# Altium schematic sheet rv_pwr_es_ctrl.SchDoc: RV Essential: Logic Controller
size A4; DocumentNumber: 3; Revision: A; SheetNumber: 3; SheetTotal: 5
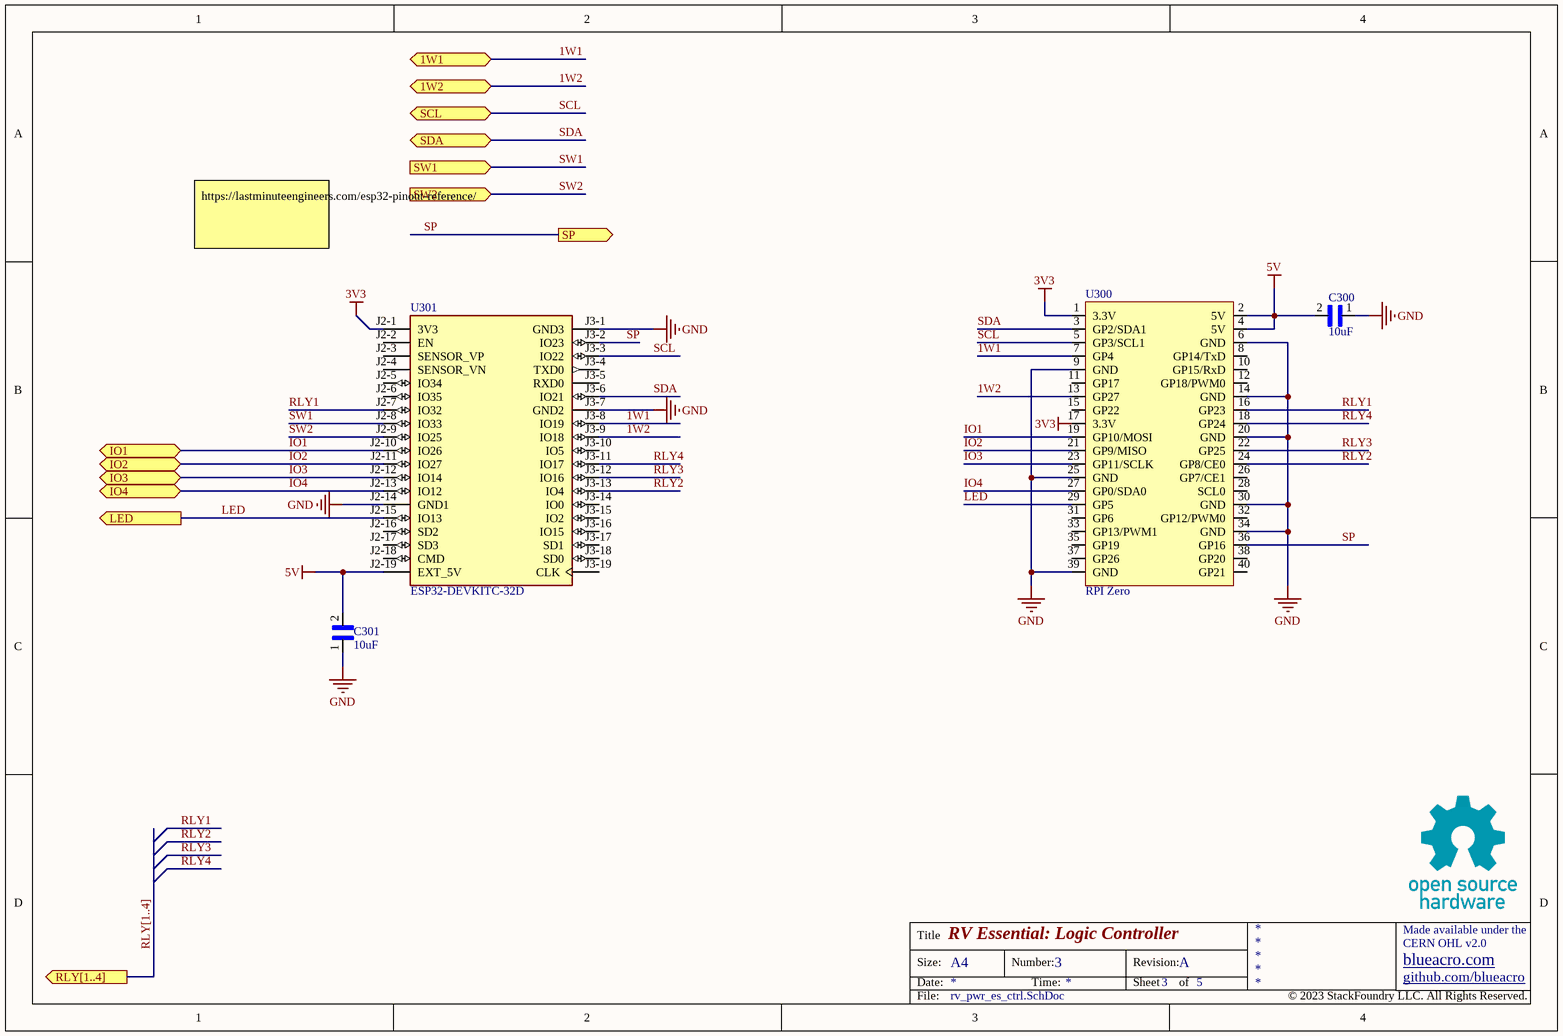
[diagram p0: rv_pwr_es_ctrl.SchDoc]

## Parts
C300  value 10uF  [CAPRB250W50L550T350H600]  (hidden comment: FG16X7R1E106KRT06)
C301  value 10uF  [CAPRB250W50L550T350H600]  (hidden comment: FG16X7R1E106KRT06)
U300  RPI Zero  [RPI_ZERO_W]
U301  ESP32-DEVKITC-32D  [MODULE_ESP32-DEVKITC-32D]

## Ports
1W1 (bidir), 1W2 (bidir), IO1 (bidir), IO2 (bidir), IO3 (bidir), IO4 (bidir), LED (out), RLY[1..4] (out), SCL (bidir), SDA (bidir), SP (out), SW1 (in), SW2 (in)

## Nets
3V3: U300.1(3.3V) U300.17(3.3V) U301.J2-1(3V3)
5V: C300.2 C301.2 U300.2(5V) U300.4(5V) U301.J2-19(EXT_5V)
GND: C300.1 C301.1 U300.6(GND) U300.9(GND) U300.14(GND) U300.20(GND) U300.25(GND) U300.30(GND) U300.34(GND) U300.39(GND) U301.J2-14(GND1) U301.J3-1(GND3) U301.J3-7(GND2)
1W1: U300.7(GP4) U301.J3-8(IO19) ; port 1W1
1W2: U300.13(GP27) U301.J3-9(IO18) ; port 1W2
IO1: U300.19(GP10/MOSI) U301.J2-10(IO26) ; port IO1
IO2: U300.21(GP9/MISO) U301.J2-11(IO27) ; port IO2
IO3: U300.23(GP11/SCLK) U301.J2-12(IO14) ; port IO3
IO4: U300.27(GP0/SDA0) U301.J2-13(IO12) ; port IO4
LED: U300.29(GP5) U301.J2-15(IO13) ; port LED
RLY1: U300.16(GP23) U301.J2-7(IO32)
RLY2: U300.24(GP8/CE0) U301.J3-13(IO4)
RLY3: U300.22(GP25) U301.J3-12(IO16)
RLY4: U300.18(GP24) U301.J3-11(IO17)
SCL: U300.5(GP3/SCL1) U301.J3-3(IO22) ; port SCL
SDA: U300.3(GP2/SDA1) U301.J3-6(IO21) ; port SDA
SP: U300.36(GP16) U301.J3-2(IO23) ; port SP
SW1: U301.J2-8(IO33) ; port SW1
SW2: U301.J2-9(IO25) ; port SW2

Not connected (* = marked no-connect by the designer): U300 8(GP14/TxD) 10(GP15/RxD) 11(GP17) 12(GP18/PWM0) 15(GP22) 26(GP7/CE1) 28(SCL0) 31(GP6) 32(GP12/PWM0) 33(GP13/PWM1) 35(GP19) 37(GP26) 38(GP20) 40(GP21); U301 J2-2(EN) J2-3(SENSOR_VP) J2-4(SENSOR_VN) J2-5(IO34) J2-6(IO35) J2-16(SD2) J2-17(SD3) J2-18(CMD) J3-4(TXD0) J3-5(RXD0) J3-10(IO5) J3-14(IO0) J3-15(IO2) J3-16(IO15) J3-17(SD1) J3-18(SD0) J3-19(CLK)

## Buses and harness runs
bus RLY[1..4] = port RLY[1..4]

## Notes on the sheet
- https://lastminuteengineers.com/esp32-pinout-reference/
- Title
- Size:
- Date:
- A4
- Number:
- Time:
- Revision:
- Sheet
- of
- github.com/blueacro
- blueacro.com
- CERN OHL v2.0
- Made available under the
- File:
- © 2023 StackFoundry LLC. All Rights Reserved.

## Library data of the parts
C300 C301 = CMP-233-000000-3: FG Series 10 uF 25 V ±10% Tolerance X7R Radial Multilayer Ceramic Capacitor; MF: TDK; Design Item ID: FG16X7R1E106KRT06; Source: FG16X7R1E106KRT06.SchLib; Component Type: Standard; Pin Count: 2; SnapEDA_Link: https://www.snapeda.com/parts/FG16X7R1E106KRT06/TDK/view-part/?ref=snap; Digi-Key_Part_Number: 445-173156-1-ND; MP: FG16X7R1E106KRT06; Purchase-URL: https://pricing.snapeda.com/search/part/FG16X7R1E106KRT06/?ref=eda; Check_prices: https://www.snapeda.com/parts/FG16X7R1E106KRT06/TDK/view-part/?ref=eda; Package: Radial TDK; Case/Package: Radial; Height - Seated (Max): 0.236inch; Lead Pitch: 0.098inch
U300 = CMP-239-000000-1: Pin Count: 40; Component Type: Standard; Design Item ID: RPI Zero; Source: pi.SchLib
U301 = CMP-237-000000-4: WiFi Development Tools (802.11) ESP32 General Development Kit, ESP32-WROOM-32D on the board; MF: Espressif Systems; Component Type: Standard; Value: *; Package: None; Source: ESP32-DEVKITC-32D.SchLib; Pin Count: 38; Price: None; Check_prices: https://www.snapeda.com/parts/ESP32-DEVKITC-32D/Espressif+Systems/view-part/?ref=eda; Design Item ID: ESP32-DEVKITC-32D; SnapEDA_Link: https://www.snapeda.com/parts/ESP32-DEVKITC-32D/Espressif+Systems/view-part/?ref=snap; MP: ESP32-DEVKITC-32D; Availability: Not in stock